# EAGLE design pwr_board (EAGLE 7.6.0)
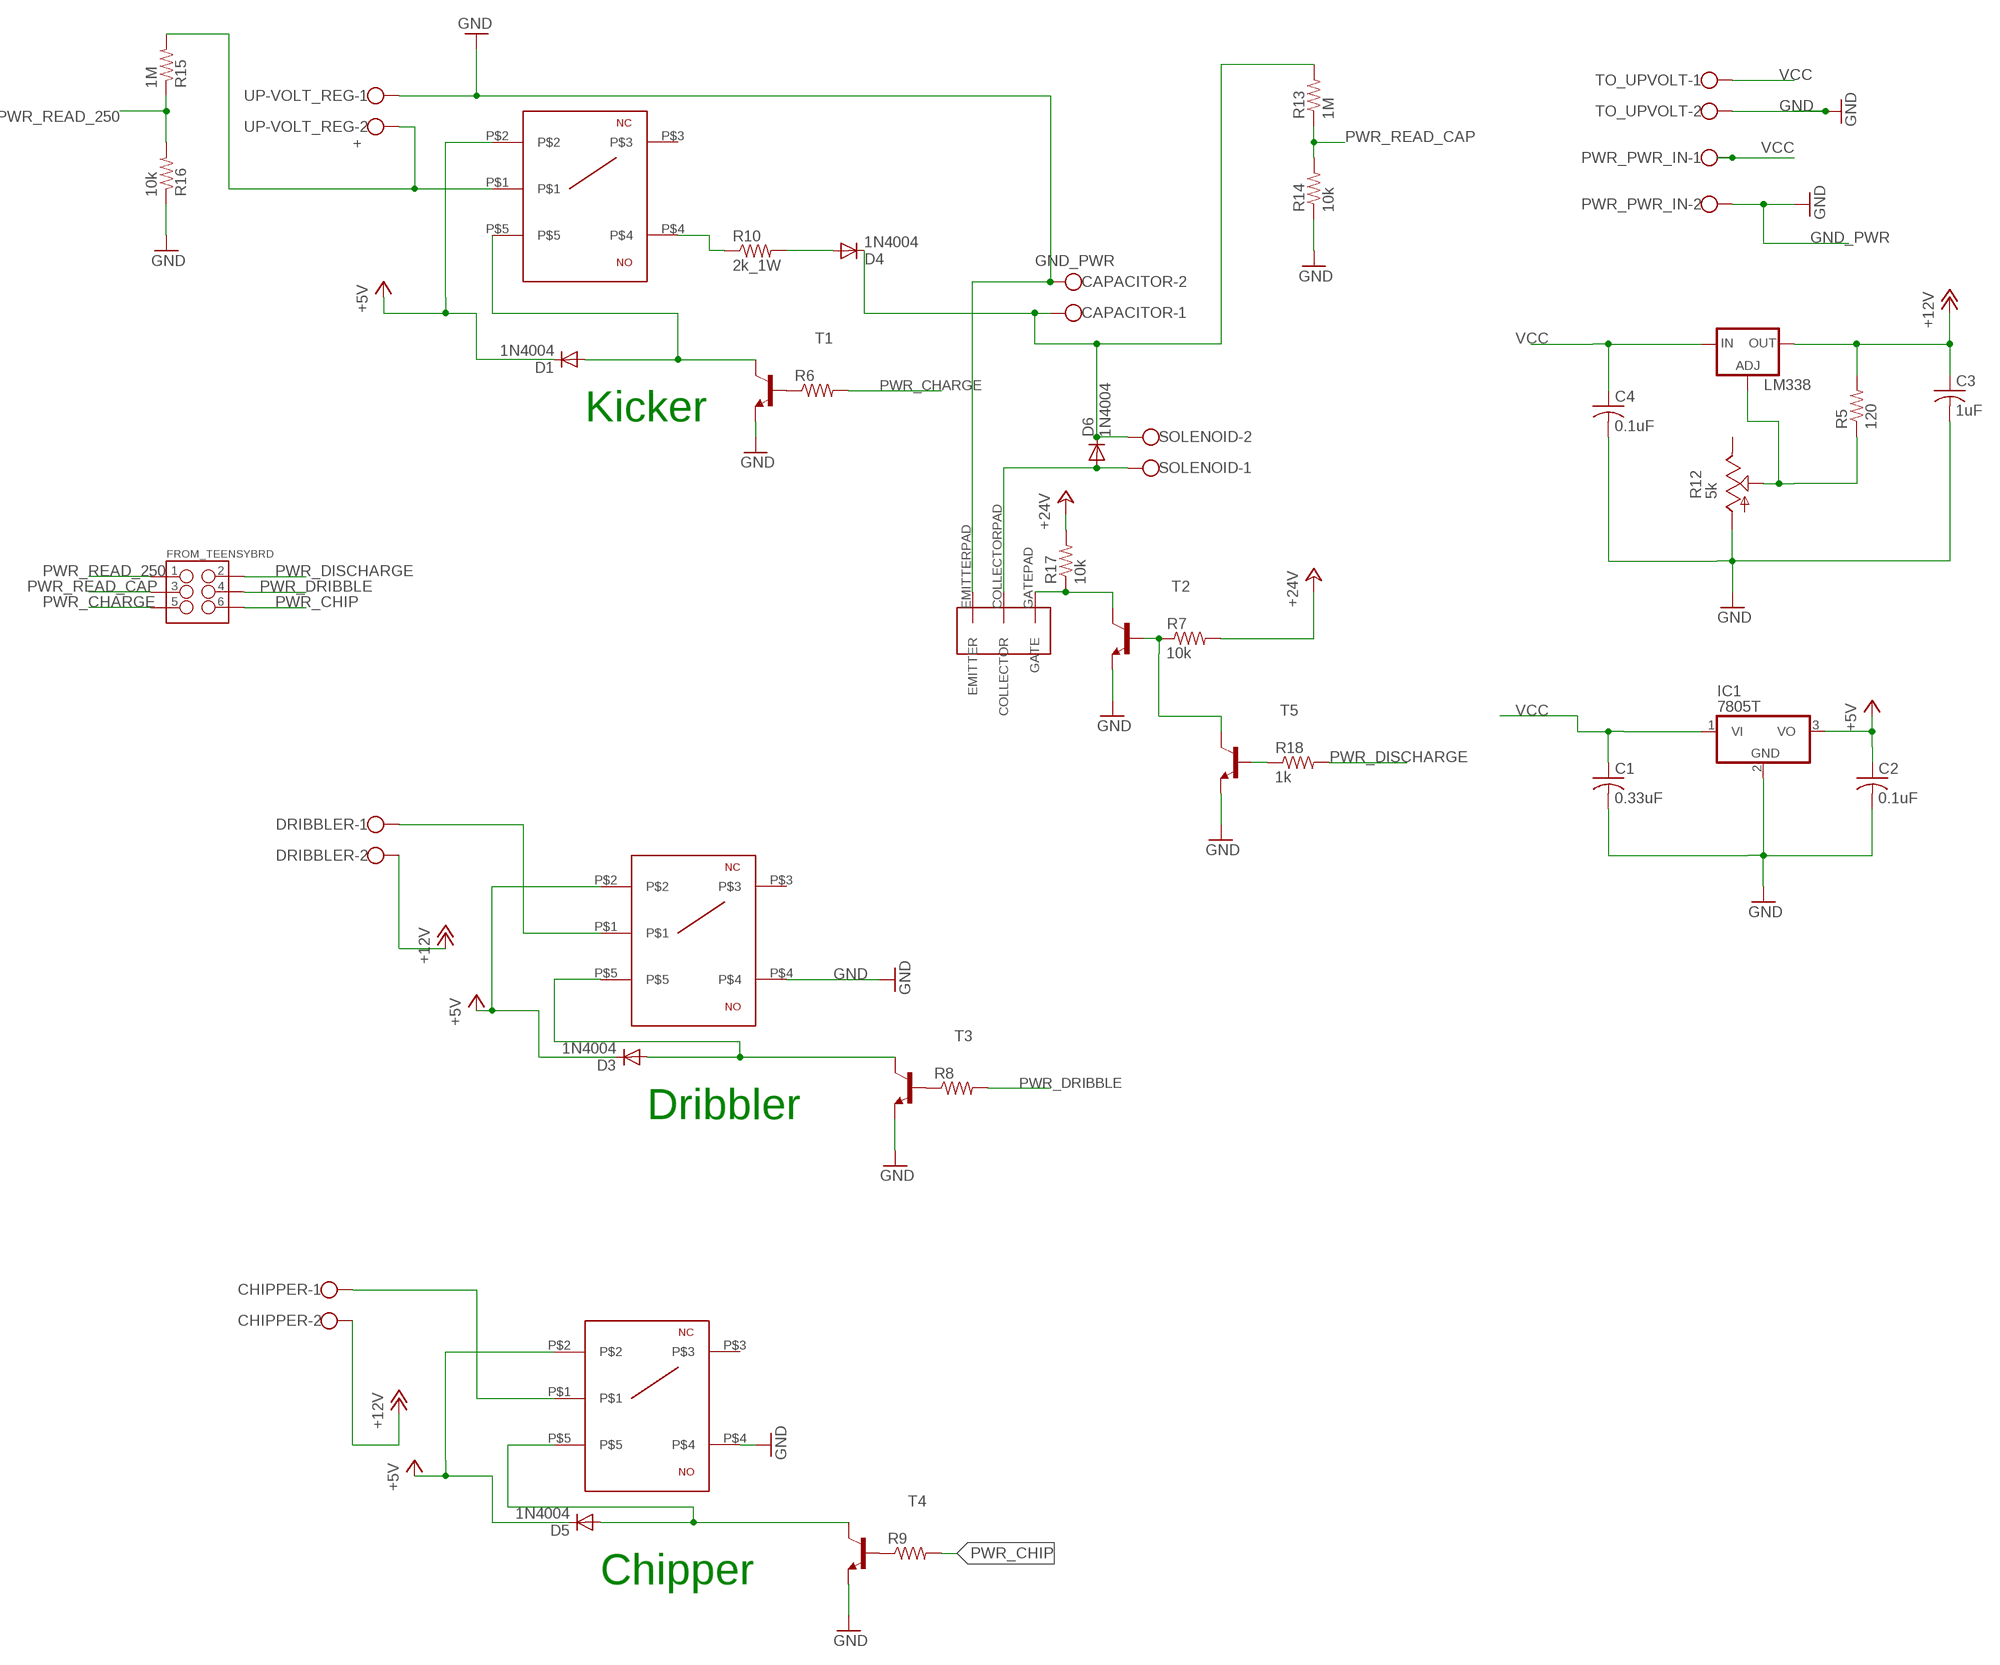
[diagram p0: schematic, sheet 1]

## Parts
C1  0.33uF  C-USC0805  [C0805]
C2  0.1uF  C-USC0805  [C0805]
C3  1uF  C-USC0805  [C0805]
C4  0.1uF  C-USC0805  [C0805]
CAPACITOR  W237-102  [W237-102]
CHIPPER  W237-102  [W237-102]
D1  1N4004  [DO41-10]
D3  1N4004  [DO41-10]
D4  1N4004  [DO41-10]
D5  1N4004  [DO41-10]
D6  1N4004  [DO41-10]
DRIBBLER  W237-102  [W237-102]
FROM_TEENSYBRD  M03X2POGO_PINS  [2X3_POGO]
IC1  7805T  [TO220H]
LM338  LM317TL  [317TL]
PWR_PWR_IN  W237-102  [W237-102]
R5  120  R-US_M0805  [M0805]
R6  R-US_0207/7  [0207/7]
R7  10k  R-US_0207/7  [0207/7]
R8  R-US_0207/7  [0207/7]
R9  R-US_0207/7  [0207/7]
R10  2k_1W  R-US_0309/12  [0309/12]
R12  5k  TRIM_US-B25P  [B25P]
R13  1M  R-US_M0805  [M0805]
R14  10k  R-US_M0805  [M0805]
R15  1M  R-US_M0805  [M0805]
R16  10k  R-US_M0805  [M0805]
R17  10k  R-US_0207/7  [0207/7]
R18  1k  R-US_0207/7  [0207/7]
SOLENOID  W237-102  [W237-102]
T1  2N3904-NPN-TO92-EBC  [TO92-EBC]
T2  2N3904-NPN-TO92-EBC  [TO92-EBC]
T3  2N3904-NPN-TO92-EBC  [TO92-EBC]
T4  2N3904-NPN-TO92-EBC  [TO92-EBC]
T5  2N3904-NPN-TO92-EBC  [TO92-EBC]
TO_UPVOLT  W237-102  [W237-102]
U$2  APT75GN120LG  [TO-264]
U$3  PANASONIC_JS1  [PANASONIC_JS1]
U$4  PANASONIC_JS1  [PANASONIC_JS1]
U$5  PANASONIC_JS1  [PANASONIC_JS1]
UP-VOLT_REG  +  W237-102  [W237-102]

## Nets
+5V: C2.1 D1.C D3.C D5.C IC1.3(VO) U$3.P$2 U$4.P$2 U$5.P$2
+12V: C3.1 CHIPPER.2 DRIBBLER.2 LM338.2(OUT) R5.2
+24V: R7.2 R17.2
GND [vcc]: C1.2 C2.2 C3.2 C4.2 IC1.2(GND) R12.A R14.1 R16.1 T1.E T2.E T3.E T4.E T5.E TO_UPVOLT.2 U$4.P$4 U$5.P$4
GND_PWR [vcc]: CAPACITOR.2 PWR_PWR_IN.2 U$2.EMITTERPAD(EMITTER) UP-VOLT_REG.1 ; supply symbol labelled GND
N$2: LM338.1(ADJ) R5.1 R12.S
N$3: R18.1 T5.B
N$4: R7.1 T2.B T5.C
N$5: R17.1 T2.C U$2.GATEPAD(GATE)
N$6: D1.A T1.C U$3.P$5
N$8: D3.A T3.C U$4.P$5
N$9: D4.A R10.2
N$10: R10.1 U$3.P$4
N$11 [vcc]: D6.A SOLENOID.1 U$2.COLLECTORPAD(COLLECTOR)
N$13 [vcc]: CAPACITOR.1 D4.C D6.C R13.2 SOLENOID.2
N$14: R15.2 U$3.P$1 UP-VOLT_REG.2
N$15: R6.1 T1.B
N$20: R8.1 T3.B
N$22: DRIBBLER.1 U$4.P$1
N$24: D5.A T4.C U$5.P$5
N$26: R9.1 T4.B
N$28: CHIPPER.1 U$5.P$1
PWR_CHARGE: FROM_TEENSYBRD.P$5 R6.2
PWR_CHIP: FROM_TEENSYBRD.P$6 R9.2
PWR_DISCHARGE: FROM_TEENSYBRD.P$2 R18.2
PWR_DRIBBLE: FROM_TEENSYBRD.P$4 R8.2
PWR_READ_250: FROM_TEENSYBRD.P$1 R15.1 R16.2
PWR_READ_CAP: FROM_TEENSYBRD.P$3 R13.1 R14.2
VCC [vcc]: C1.1 C4.1 IC1.1(VI) LM338.3(IN) PWR_PWR_IN.1 TO_UPVOLT.1
Unconnected: R12.E U$3.P$3 U$4.P$3 U$5.P$3

## Notes on the sheet
- Kicker
- Dribbler
- Chipper

## Library data of the parts
C1-C4 = adafruit:C-US: CAPACITOR, American symbol
CAPACITOR CHIPPER DRIBBLER PWR_PWR_IN SOLENOID TO_UPVOLT UP-VOLT_REG = con-wago-500:W237-102: WAGO SCREW CLAMP; MPN: 237-102; OC_FARNELL: unknown; OC_NEWARK: 70K9898
D1 D3-D6 = diode:1N4004: DIODE general purpose rectifier, 1 A
FROM_TEENSYBRD = SparkFun-Connectors:M03X2: 2x3 .1" header. Shrouded, with keying- CONN-10681 SMT- CONN-11415 Pogo pins- HW-11044; PROD_ID: HW-11044
IC1 = linear:78*: Positive VOLTAGE REGULATOR Source: http://cache.national.com/ds/LM/LM78L05.pdf http://www.fairchildsemi.com/ds/LM/LM7805.pdf
LM338 = v-reg:LM317TL: VOLTAGE REGULATOR
R5-R10 R13-R18 = resistor:R-US_: RESISTOR, American symbol
R12 = pot:TRIM_US-: POTENTIOMETER
T1-T5 = transistor-neu-to92:*-NPN-: NPN Transistror
U$2 = igbt:APT75GN120LG
U$3-U$5 = RoboBulls_relay:PANASONIC_JS1

## Net classes
0 default: width 0.508 mm, clearance 0.508 mm
1 vcc: width 1.524 mm, clearance 0.762 mm

## Board
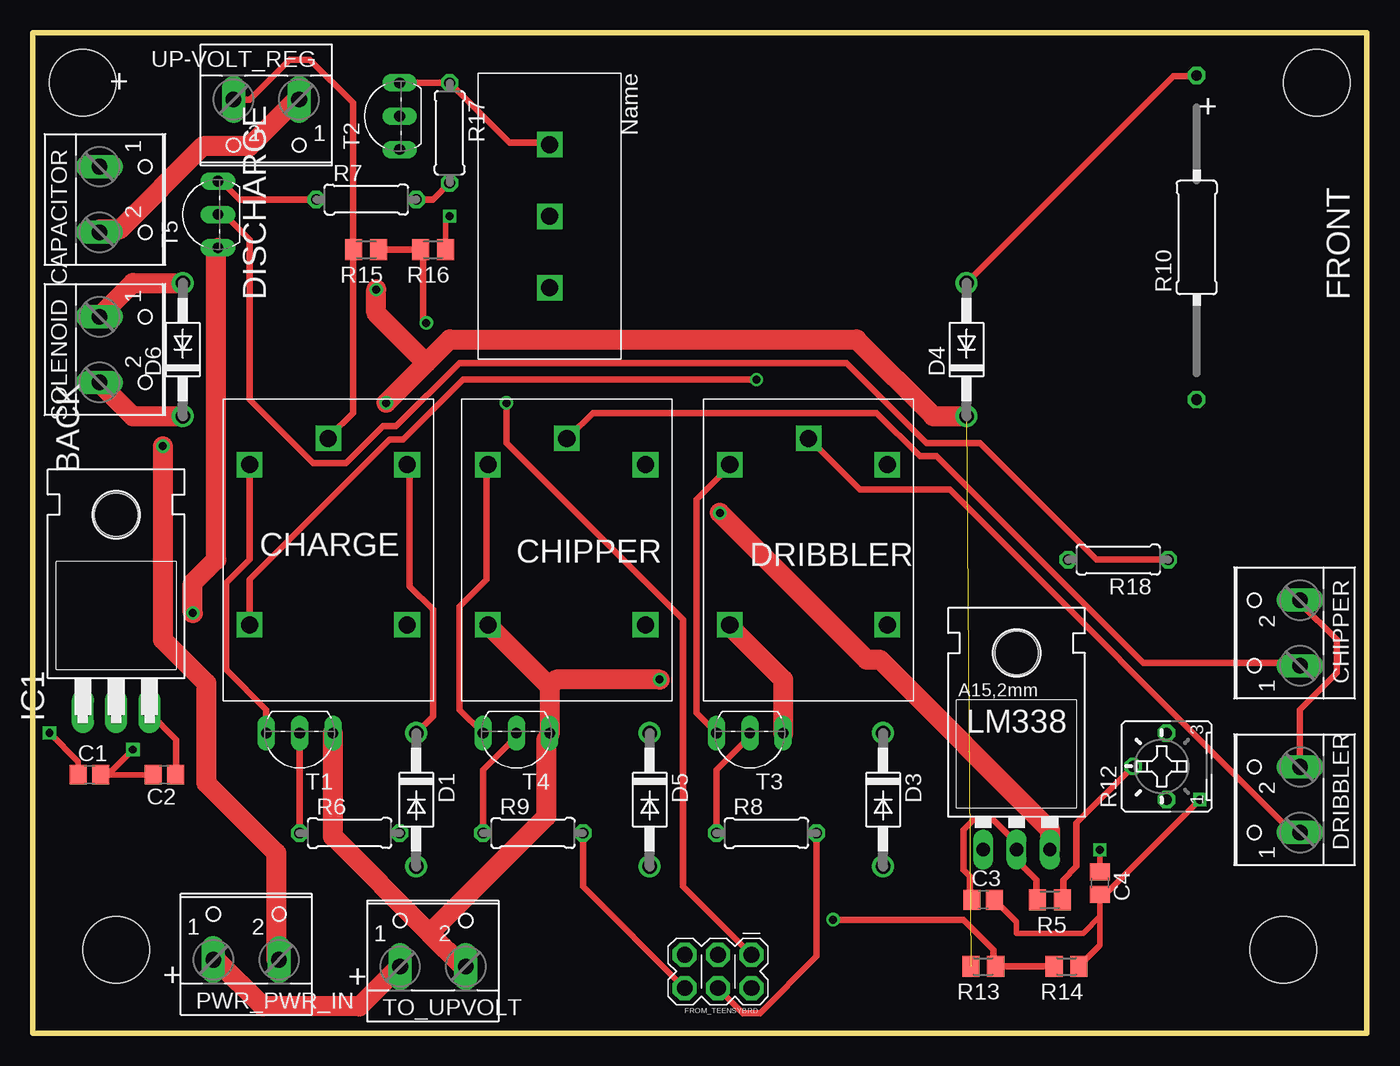
[diagram p1: board, top side]
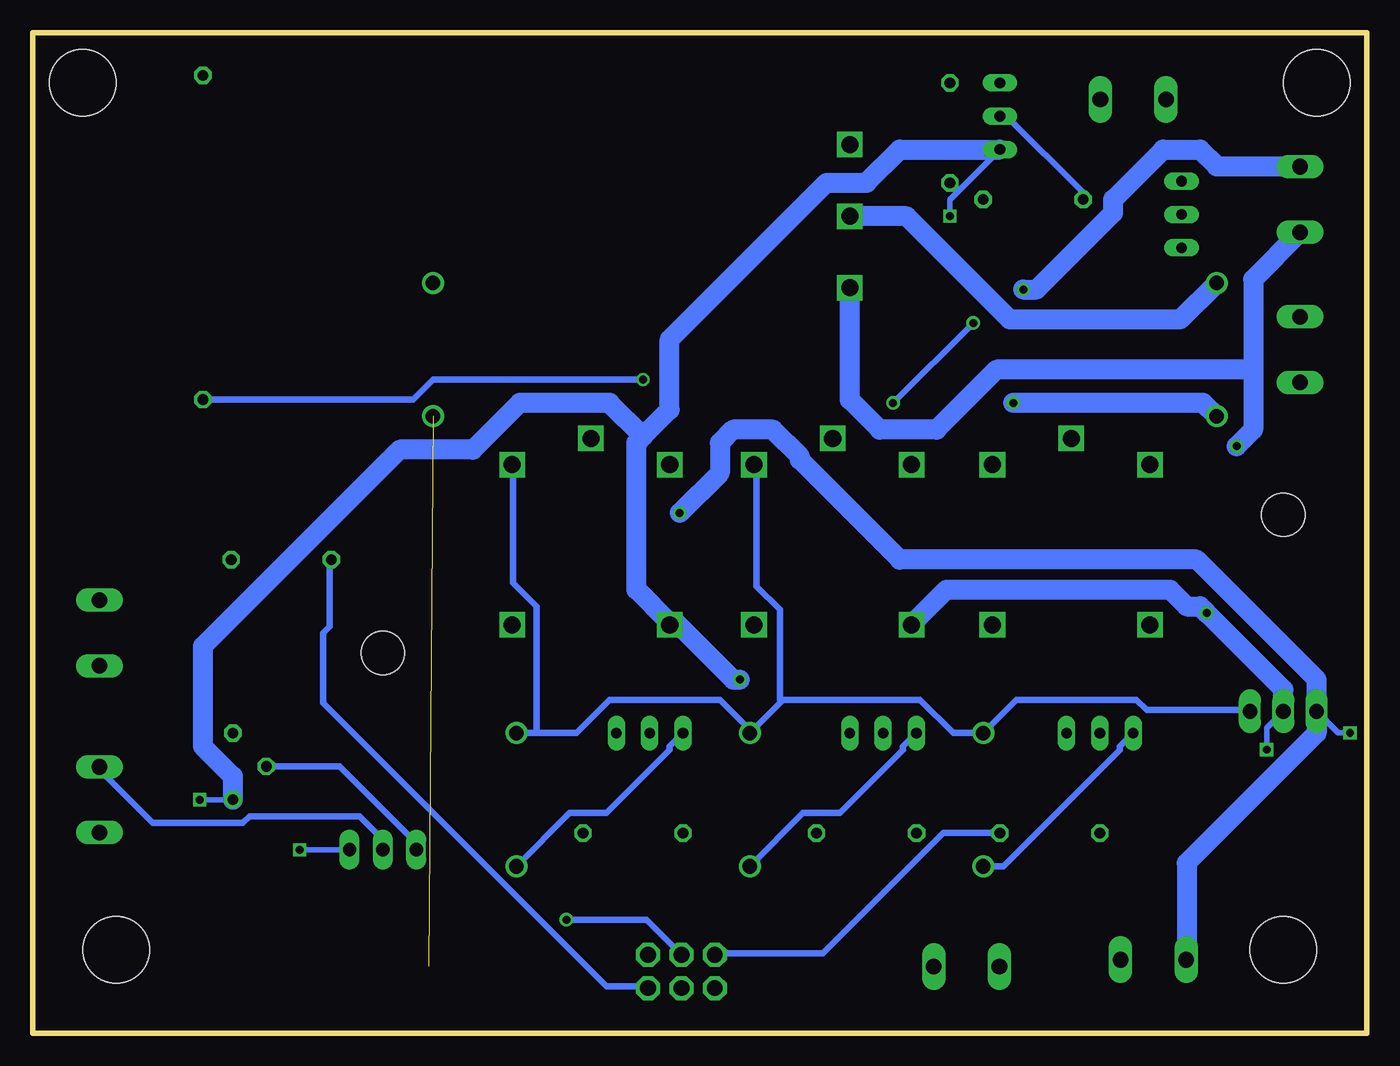
[diagram p2: board, bottom side, seen from below]

Size 101.6 x 76.2 mm. Coordinates in mm from the lower left corner, seen from the top.
Outline: 0,0 0,76.2 101.6,76.2 101.6,0 0,0
Copper layers (1*16): Top 0.035mm / dielectric 1.5mm / Bottom 0.035mm
Design rules "default": minimum track width 10mil, minimum drill 24mil, track to track 8mil, track to pad 8mil, pad to pad 8mil, via to via 8mil, smd to smd 8mil, copper to edge 40mil, drill to drill 8mil, minimum pad ring 10mil, minimum via ring 8mil, stop-mask expansion 4mil, vias tented up to drill 0mil, thermal gap 10mil
Holes 5.08 mm at 6.35,6.35 95.25,6.35 3.81,72.39 97.79,72.39

### Footprints (pad centres in the part's own frame; a part is rotated, then mirrored left to right if it is on the bottom)
C0805 = smd 1.3 x 1.5: 1 -0.85,0; 2 0.85,0
W237-102 = drill 1.194 long: 1 -2.5,-1.27; 2 2.5,-1.27
DO41-10 = drill 1.118: A 5.08,0; C -5.08,0
2X3_POGO = drill 1.2 pad 1.829 octagon: P$1 0,0; P$2 0,2.54; P$3 2.54,0; P$4 2.54,2.54; P$5 5.08,0; P$6 5.08,2.54
TO220H = drill 1.118 long: 1 -2.54,-10.16; 2 0,-10.16; 3 2.54,-10.16 | hole 3.302: 0,4.826
317TL = drill 1.016 long: 1 -2.54,-3.81; 2 0,-3.81; 3 2.54,-3.81 | hole 3.302: 0,11.176
M0805 = smd 1.3 x 1.6: 1 -0.95,0; 2 0.95,0
0207/7 = drill 0.813 octagon: 1 -3.81,0; 2 3.81,0
0309/12 = drill 0.813 octagon: 1 -6.35,0; 2 18.35,0
B25P = drill 0.813 octagon: A -2.54,0; E 2.54,0; S 0,2.54
TO92-EBC = drill 0.813 long: B 0,-1.27; C 2.54,-1.27; E -2.54,-1.27
TO-264 = drill 1.295 square: COLLECTORPAD 0,0; EMITTERPAD 5.45,0; GATEPAD -5.45,0
PANASONIC_JS1 = drill 1.3 square: P$1 -2,6; P$2 0,12; P$3 12.2,12; P$4 12.2,0; P$5 0,0

### Placement (x,y rotation side)
C1  4.32,19.68 0 top
C2  10.03,19.68 180 top
C3  72.39,10.16 0 top
C4  81.28,11.43 270 top
CAPACITOR  6.35,63.5 270 top
CHIPPER  95.25,30.48 90 top
D1  29.21,17.78 270 top
D3  64.77,17.78 270 top
D4  71.12,52.07 90 top
D5  46.99,17.78 270 top
D6  11.43,52.07 90 top
DRIBBLER  95.25,17.78 90 top
FROM_TEENSYBRD  54.74,5.97 180 top
IC1  6.35,34.67 0 top
LM338  74.93,17.78 0 top
PWR_PWR_IN  16.26,6.86 0 top
R5  77.47,10.16 180 top
R6  24.13,15.24 0 top
R7  25.4,63.5 0 top
R8  55.88,15.24 0 top
R9  38.1,15.24 0 top
R10  88.65,54.61 90 top
R12  86.36,20.32 90 top
R13  72.39,5.08 180 top
R14  78.74,5.08 180 top
R15  25.4,59.69 180 top
R16  30.48,59.69 180 top
R17  31.75,68.58 270 top
R18  82.68,36.07 180 top
SOLENOID  6.35,52.07 270 top
T1  20.32,21.59 180 top
T2  26.67,69.85 90 top
T3  54.61,21.59 180 top
T4  36.83,21.59 180 top
T5  12.83,62.36 90 top
TO_UPVOLT  30.48,6.35 0 top
U$2  39.37,62.23 270 top
U$3  16.51,43.31 270 top
U$4  53.09,43.31 270 top
U$5  34.67,43.31 270 top
UP-VOLT_REG  17.78,69.85 180 top

### Tracks (layer width: path | path; a pad name or v marks a point on that pad's centre or on a via)
+5V
  Top 0.508: C2.1 10.92,19.81 10.92,22.35 8.89,24.38 IC1.3 | D1.C 30.48,24.13 30.48,32.26 28.7,34.04 28.7,43.18 U$3.P$2
  Bottom 0.508: 44.58,25.27 D5.C 46.99,23.11 49.28,25.4 57.66,25.4 60.2,22.86 63.25,22.86 | 44.58,25.27 44.45,25.4 34.04,25.4 31.5,22.86 D1.C 26.67,25.4 17.53,25.4 16.76,24.64 8.89,24.64 IC1.3 | 63.25,22.86 D3.C | U$5.P$2 46.48,43.18 46.48,34.04 44.7,32.26 44.7,25.4 44.58,25.27 | 63.25,22.86 63.25,32.51 65.02,34.29 65.02,43.18 U$4.P$2
+12V
  Top 0.508: C3.1 71.37,10.16 71.37,11.94 70.87,12.45 70.87,15.49 71.63,16.26 73.15,16.26 74.93,14.48 LM338.2 74.93,13.21 76.45,11.68 76.45,10.16 R5.2 | DRIBBLER.2 96.52,24.64 99.31,27.43 99.31,29.97 96.52,32.77 CHIPPER.2
  Bottom 0.508: LM338.2 74.93,14.73 76.71,16.51 85.09,16.51 85.6,16 92.46,16 96.52,20.07 DRIBBLER.2
+24V
  Top 0.508: R7.2 30.48,63.5 R17.2
GND  (via drill 0.6, 0.61)
  Top 0.406: C4.2 81.7,10.58 v88.9,17.78 | C4.2 81.28,6.67 R14.1 | C4.2 81.28,8.89 80.01,7.62 74.93,7.62 74.93,8.47 C3.2 | R16.1 31.43,61.91 v31.75,62.23 | C2.2 C1.2 5.71,19.68 v7.62,21.59
  Top 1.524: v12.19,32 12.19,34.29 13.97,36.07 13.97,59.69 T5.E | 39.37,26.42 T4.E 39.12,22.35 39.12,16.51 30.23,7.62 | 39.37,26.42 34.8,30.99 U$5.P$4 | T1.E 22.86,14.99 30.23,7.62 | 30.23,7.62 32.77,5.08 TO_UPVOLT.2 | T3.E 57.15,26.92 53.09,30.99 U$4.P$4 | v47.75,26.92 39.88,26.92 39.37,26.42
  Bottom 0.406: v88.9,17.78 R12.A | v31.75,62.23 31.75,63.5 T2.E | v7.62,21.59 7.62,23.24 IC1.2
  Bottom 1.524: IC1.2 6.35,26.16 v12.19,32 12.7,32.51 13.72,32.51 14.99,33.78 32,33.78 34.54,31.24 U$5.P$4 | T2.E 35.56,67.31 38.1,64.77 41.15,64.77 53.09,52.83 53.09,47.5 55.12,45.47 | 55.12,45.47 55.63,44.96 55.63,33.78 53.09,31.24 U$4.P$4 52.58,31.24 48.26,26.92 v47.75,26.92 | R12.A 86.36,19.56 88.65,21.84 88.65,29.46 73.66,44.45 68.07,44.45 64.52,48.01 57.66,48.01 55.12,45.47
GND_PWR  (via drill 0.61)
  Top 1.524: CAPACITOR.2 5.08,61.21 6.6,61.21 12.95,67.56 16.51,67.56 20.07,71.12 UP-VOLT_REG.1 | v9.91,44.7 9.91,29.97 13.21,26.67 13.21,19.05 18.54,13.72 18.54,5.59 PWR_PWR_IN.2
  Bottom 1.524: v9.91,44.7 8.64,45.97 8.64,50.55 | 8.64,50.55 8.64,57.4 5.08,60.96 CAPACITOR.2 | U$2.EMITTERPAD 39.37,48.26 37.08,45.97 32.77,45.97 28.19,50.55 8.64,50.55
N$2
  Top 0.508: R12.S 79.5,16 79.5,12.7 78.49,11.68 78.49,10.16 R5.1
  Bottom 0.508: LM338.1 72.39,14.48 78.23,20.32 R12.S
N$3
  Top 0.508: R18.1 81.03,36.07 72.14,44.96 68.07,44.96 61.98,51.05 32.51,51.05 27.69,46.23 26.67,46.23 23.88,43.43 21.34,43.43 16.51,48.26 16.51,60.45 14.73,62.23 14.22,62.23 T5.B
N$4
  Top 0.508: R7.1 15.75,63.5 14.22,65.02 T5.C
  Bottom 0.508: T2.B 27.43,69.85 21.59,64.01 R7.1
N$5
  Top 0.508: T2.C R17.1 36.32,67.82 39.37,67.82 U$2.GATEPAD
N$6
  Top 0.508: U$3.P$5 16.51,36.07 14.73,34.29 14.73,27.69 17.78,24.64 T1.C
  Bottom 0.508: T1.C 18.8,21.84 18.8,21.59 27.69,12.7 D1.A
N$8
  Top 0.508: T3.C 50.55,24.38 50.55,40.64 53.09,43.18 U$4.P$5
  Bottom 0.508: T3.C 53.09,21.84 53.09,21.59 57.91,16.76 60.71,16.76 D3.A
N$9
  Top 0.508: D4.A 86.87,72.9 88.65,72.9 R10.2
N$10  (via drill 0.61)
  Top 0.508: v55.12,49.78 32.77,49.78 28.19,45.21 27.18,45.21 16.51,34.54 U$3.P$4
  Bottom 0.508: R10.1 72.64,48.26 71.12,49.78 v55.12,49.78
N$11
  Top 1.524: D6.A 7.62,57.15 5.08,54.61 SOLENOID.1
  Bottom 1.524: U$2.COLLECTORPAD 35.05,62.23 27.18,54.36 14.22,54.36 D6.A
N$13  (via drill 0.61)  (1 unrouted)
  Top 1.524: D6.C 7.62,46.99 5.08,49.53 SOLENOID.2 | D4.C 68.58,46.99 62.74,52.83 31.75,52.83 29.97,51.05 | v26.92,48.01 29.97,51.05 | v26.16,56.64 26.16,54.86 29.97,51.05
  Bottom 1.524: v26.92,48.01 12.45,48.01 D6.C | v26.16,56.64 25.15,56.64 19.3,62.48 19.3,63.5 15.49,67.31 12.7,67.31 11.43,66.04 5.08,66.04 CAPACITOR.1
N$14
  Top 0.508: 24.38,59.69 24.38,47.24 22.61,45.47 U$3.P$1 | UP-VOLT_REG.2 16.51,71.12 19.56,74.17 21.08,74.17 24.38,70.87 24.38,59.69 | 24.38,59.69 R15.2
N$15
  Top 0.508: T1.B R6.1
N$20
  Top 0.508: R8.1 52.07,20.07 54.61,22.61 T3.B
N$22
  Top 0.508: DRIBBLER.1 96.52,15.49 95.76,15.49 69.85,41.4 62.99,41.4 59.18,45.21 U$4.P$1
N$24
  Top 0.508: T4.C 32.51,24.64 32.51,32.51 34.54,34.54 34.54,43.18 U$5.P$5
  Bottom 0.508: T4.C 35.31,21.84 35.31,21.59 40.13,16.76 42.93,16.76 D5.A
N$26
  Top 0.508: R9.1 34.29,20.07 36.83,22.61 T4.B
N$28
  Top 0.508: CHIPPER.1 96.52,28.19 84.58,28.19 68.83,43.94 67.56,43.94 64.26,47.24 42.67,47.24 40.89,45.47 U$5.P$1
PWR_CHARGE
  Bottom 0.508: R6.2 32.26,15.24 41.4,6.1 49.53,6.1 FROM_TEENSYBRD.P$5
PWR_CHIP
  Top 0.508: R9.2 41.91,11.18 FROM_TEENSYBRD.P$6
PWR_DISCHARGE
  Bottom 0.508: R18.2 78.99,36.07 78.99,30.99 79.5,30.48 79.5,25.15 57.91,3.56 54.86,3.56 FROM_TEENSYBRD.P$2
PWR_DRIBBLE
  Top 0.508: R8.2 59.69,5.84 55.37,1.52 54.1,1.52 FROM_TEENSYBRD.P$4
PWR_READ_250  (via drill 0.61)
  Top 0.508: R15.1 R16.2 29.72,59.69 29.72,54.36 v29.97,54.1 | v36.07,48.01 36.07,44.96 49.53,31.5 49.53,11.18 FROM_TEENSYBRD.P$1
  Bottom 0.508: v36.07,48.01 v29.97,54.1
PWR_READ_CAP  (via drill 0.61)
  Top 0.508: R14.2 R13.1 73.15,5.08 73.15,6.35 70.87,8.64 v60.96,8.64
  Bottom 0.508: v60.96,8.64 54.86,8.64 FROM_TEENSYBRD.P$3
VCC  (via drill 0.6, 0.61)
  Top 0.406: C4.1 v81.28,13.97 | C1.1 3.47,20.66 v1.27,22.86
  Top 1.524: PWR_PWR_IN.1 13.97,5.59 17.53,2.03 24.89,2.03 27.94,5.08 TO_UPVOLT.1 | LM338.3 77.47,15.49 64.52,28.45 63.5,28.45 v52.32,39.62
  Bottom 0.406: v81.28,13.97 LM338.3 | v1.27,22.86 2.16,22.86 IC1.1
  Bottom 1.524: v52.32,39.62 49.28,42.67 49.28,44.96 48.26,45.97 45.21,45.97 43.18,43.94 43.18,43.69 35.56,36.07 12.95,36.07 3.81,26.92 IC1.1 3.81,22.86 13.72,12.95 13.72,5.59 PWR_PWR_IN.1

### Text on the board
tPlace: + | + | DISCHARGE | FRONT | BACK | CHARGE | CHIPPER | DRIBBLER | + | +